# EAGLE board sd2snes17 (EAGLE 4.15), part 1 of 2
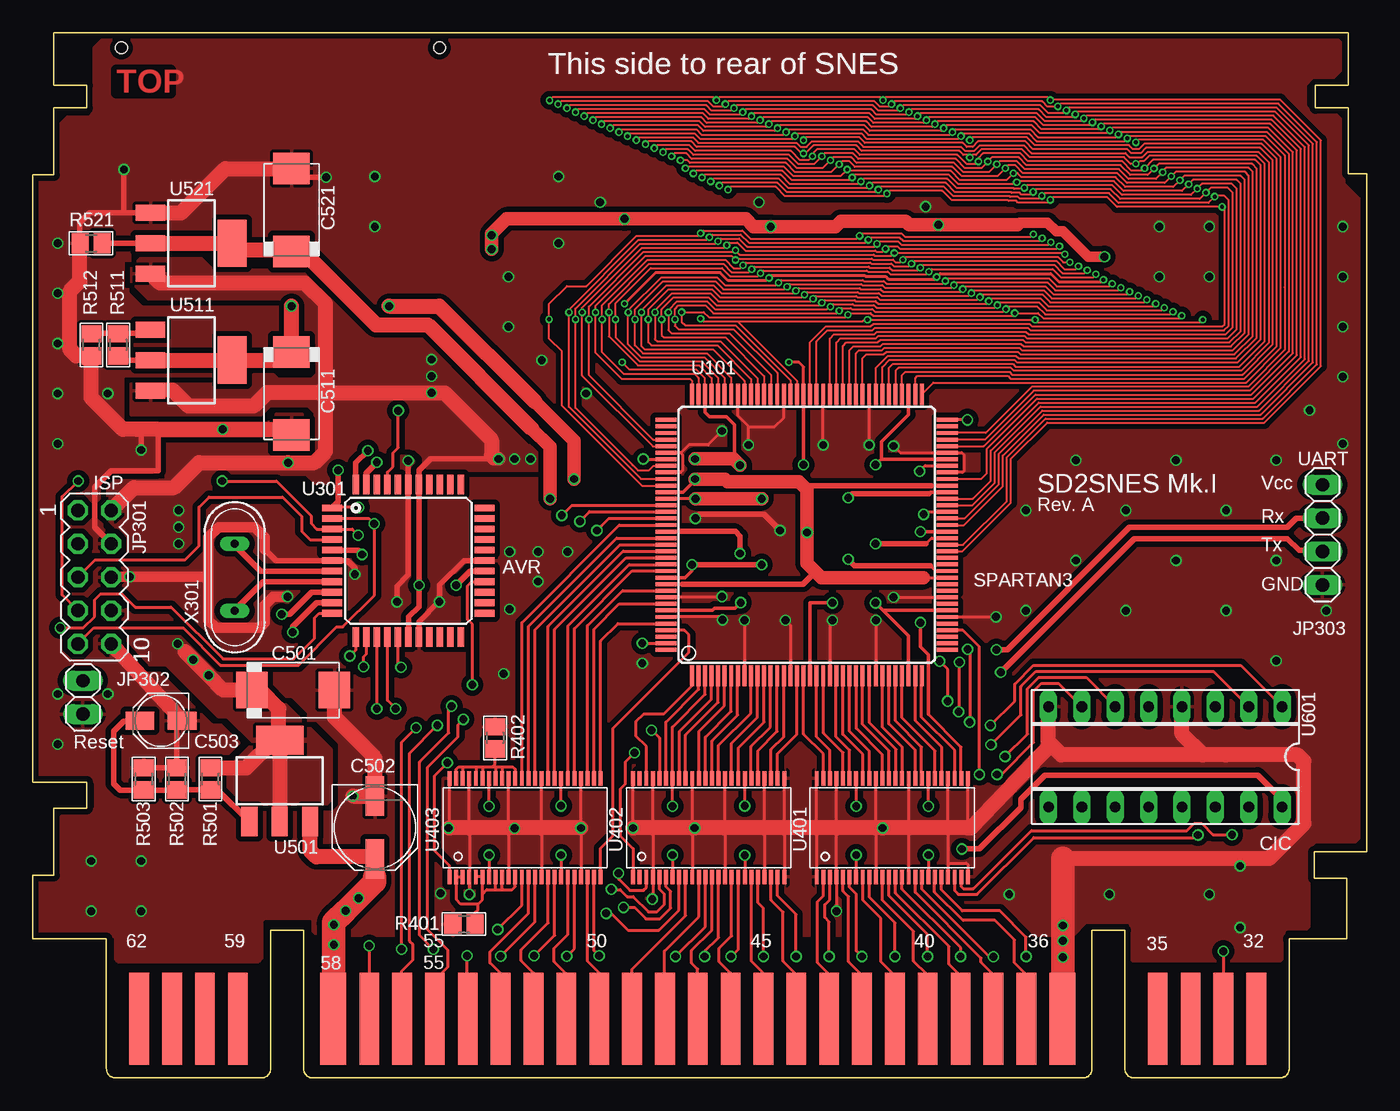
[diagram p4: board, top side]
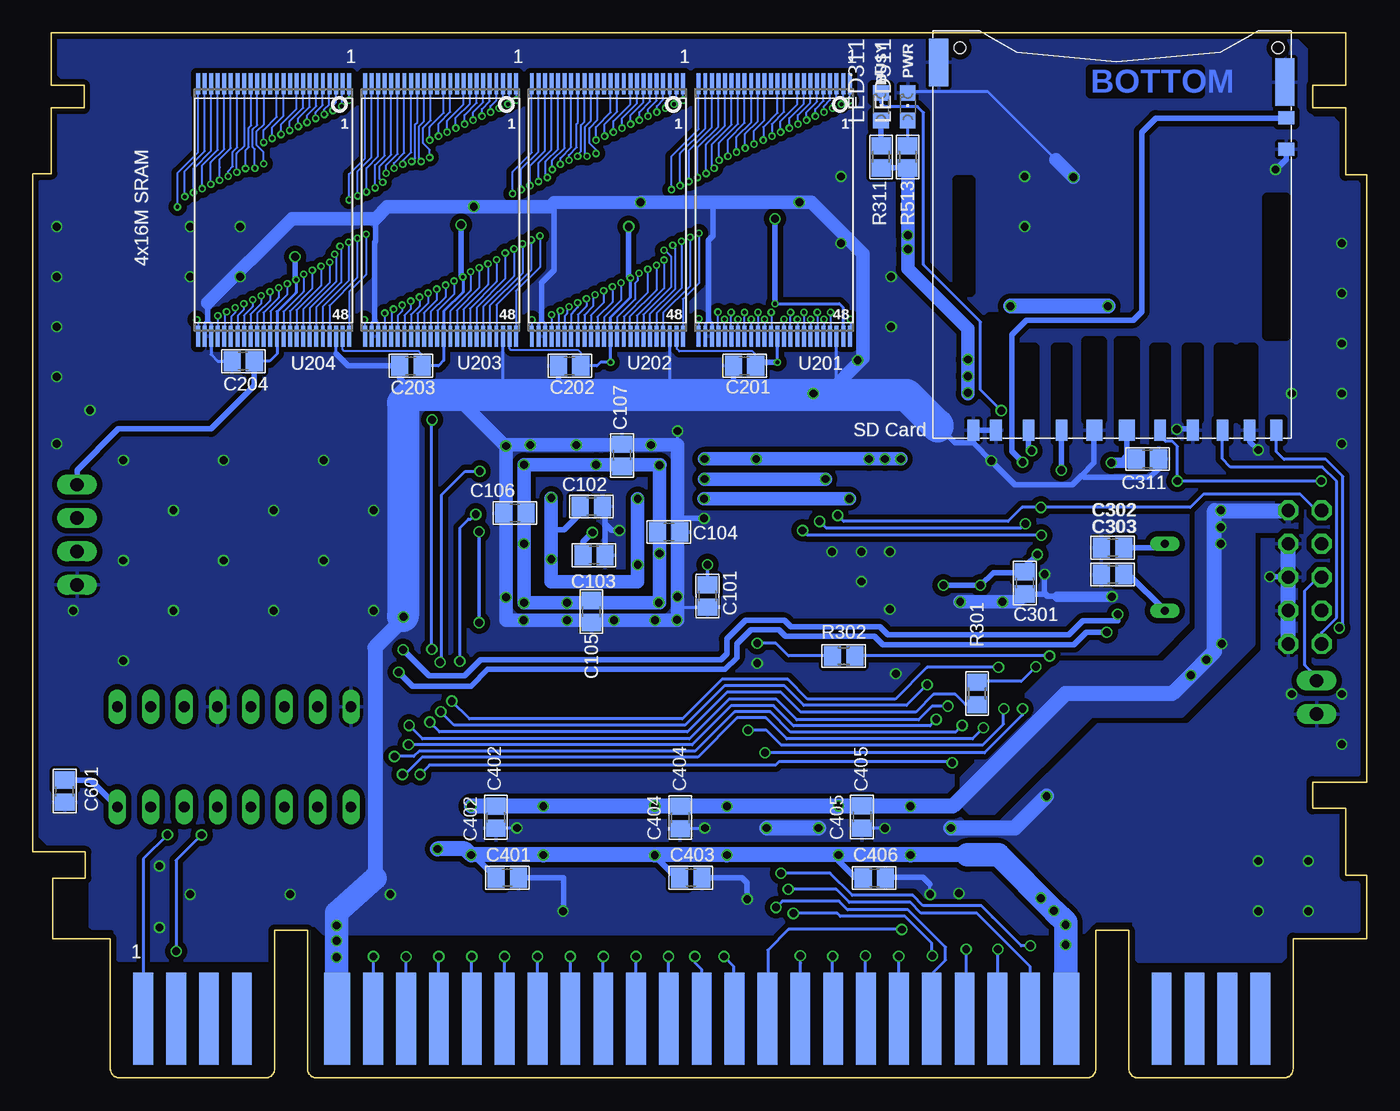
[diagram p5: board, bottom side, seen from below]

Size 101.5 x 79.5 mm. Coordinates in mm from the lower left corner, seen from the top.
Copper layers (1*16): Top 0.035mm / dielectric 1mm / Bottom 0.035mm
Design rules "myBilex DRU": minimum track width 0.15mm, minimum drill 0.3mm, track to track 0.15mm, track to pad 0.15mm, pad to pad 0.15mm, via to via 0.15mm, smd to smd 0.15mm, copper to edge 10mil, drill to drill 8mil, minimum pad ring 10mil, minimum via ring 5mil, stop-mask expansion 4mil, vias tented up to drill 0mil, thermal gap 10mil

## Footprints (pad centres in the part's own frame; a part is rotated, then mirrored left to right if it is on the bottom)
C0805 = smd 1.3 x 1.5: 1 -0.85,0; 2 0.85,0
SMC_D = smd 2.4 x 2.8: + -3.15,0; - 3.15,0
PANASONIC_D = smd 3 x 1.4: + 2.4,0; - -2.4,0
PANASONIC_B = smd 2.2 x 1.4: + 1.6,0; - -1.6,0
SNESCART = smd 1.5 x 7: 1 -42.5,-0.5; 2 -40,-0.5; 3 -37.5,-0.5; 4 -35,-0.5; 6 -25,-0.5; 7 -22.5,-0.5; 8 -20,-0.5; 9 -17.5,-0.5; 10 -15,-0.5; 11 -12.5,-0.5; 12 -10,-0.5; 13 -7.5,-0.5; 14 -5,-0.5; 15 -2.5,-0.5; 16 0,-0.5; 17 2.5,-0.5; 18 5,-0.5; 19 7.5,-0.5; 20 10,-0.5; 21 12.5,-0.5; 22 15,-0.5; 23 17.5,-0.5; 24 20,-0.5; 25 22.5,-0.5; 26 25,-0.5; 28 35,-0.5; 29 37.5,-0.5; 30 40,-0.5; 31 42.5,-0.5 | smd 2 x 7: 5 -27.75,-0.5; 27 27.75,-0.5 | smd 1.5 x 7 bottom: 32 -42.5,-0.5; 33 -40,-0.5; 34 -37.5,-0.5; 35 -35,-0.5; 37 -25,-0.5; 38 -22.5,-0.5; 39 -20,-0.5; 40 -17.5,-0.5; 41 -15,-0.5; 42 -12.5,-0.5; 43 -10,-0.5; 44 -7.5,-0.5; 45 -5,-0.5; 46 -2.5,-0.5; 47 0,-0.5; 48 2.5,-0.5; 49 5,-0.5; 50 7.5,-0.5; 51 10,-0.5; 52 12.5,-0.5; 53 15,-0.5; 54 17.5,-0.5; 55 20,-0.5; 56 22.5,-0.5; 57 25,-0.5; 59 35,-0.5; 60 37.5,-0.5; 61 40,-0.5; 62 42.5,-0.5 | smd 2 x 7 bottom: 36 -27.75,-0.5; 58 27.75,-0.5
JAE-SG5S009V1A = smd 0.9 x 1.6: 1 6.875,14.44; 2 4.375,14.44; 5 -3.125,14.44; 6 -5.625,14.44; 7 -7.875,14.44; 8 -9.925,14.44; 9 9.375,14.44; CARD_DET1 -11.975,14.44; CARD_DET2 11.075,14.44 | smd 1.2 x 1.6: 3 1.875,14.44; 4 -0.6,14.44 | smd 1.45 x 3.6: GND -12.625,-12.06; GND@1 13.725,-13.56 | smd 1.25 x 1: WP_1 -12.725,-9.36; WP_2 -12.725,-6.96 | hole 0.9: -12.1,-14.66; 12.1,-14.66
MA05-2 = drill 1.016 octagon: 1 -5.08,-1.27; 2 -5.08,1.27; 3 -2.54,-1.27; 4 -2.54,1.27; 5 0,-1.27; 6 0,1.27; 7 2.54,-1.27; 8 2.54,1.27; 9 5.08,-1.27; 10 5.08,1.27
1X02 = drill 1.016 long: 1 -1.27,0; 2 1.27,0
1X04 = drill 1.016 long: 1 -3.81,0; 2 -1.27,0; 3 1.27,0; 4 3.81,0
CHIPLED_0805 = smd 1.2 x 1.2: A 0,-1.05; C 0,1.05
R0805 = smd 1.3 x 1.5: 1 -0.85,0; 2 0.85,0
TQ144 = smd 1.6 x 0.3: P1 -10.7,8.75; P2 -10.7,8.25; P3 -10.7,7.75; P4 -10.7,7.25; P5 -10.7,6.75; P6 -10.7,6.25; P7 -10.7,5.75; P8 -10.7,5.25; P9 -10.7,4.75; P10 -10.7,4.25; P11 -10.7,3.75; P12 -10.7,3.25; P13 -10.7,2.75; P14 -10.7,2.25; P15 -10.7,1.75; P16 -10.7,1.25; P17 -10.7,0.75; P18 -10.7,0.25; P19 -10.7,-0.25; P20 -10.7,-0.75; P21 -10.7,-1.25; P22 -10.7,-1.75; P23 -10.7,-2.25; P24 -10.7,-2.75; P25 -10.7,-3.25; P26 -10.7,-3.75; P27 -10.7,-4.25; P28 -10.7,-4.75; P29 -10.7,-5.25; P30 -10.7,-5.75; P31 -10.7,-6.25; P32 -10.7,-6.75; P33 -10.7,-7.25; P34 -10.7,-7.75; P35 -10.7,-8.25; P36 -10.7,-8.75; P73 10.7,-8.75; P74 10.7,-8.25; P75 10.7,-7.75; P76 10.7,-7.25; P77 10.7,-6.75; P78 10.7,-6.25; P79 10.7,-5.75; P80 10.7,-5.25; P81 10.7,-4.75; P82 10.7,-4.25; P83 10.7,-3.75; P84 10.7,-3.25; P85 10.7,-2.75; P86 10.7,-2.25; P87 10.7,-1.75; P88 10.7,-1.25; P89 10.7,-0.75; P90 10.7,-0.25; P91 10.7,0.25; P92 10.7,0.75; P93 10.7,1.25; P94 10.7,1.75; P95 10.7,2.25; P96 10.7,2.75; P97 10.7,3.25; P98 10.7,3.75; P99 10.7,4.25; P100 10.7,4.75; P101 10.7,5.25; P102 10.7,5.75; P103 10.7,6.25; P104 10.7,6.75; P105 10.7,7.25; P106 10.7,7.75; P107 10.7,8.25; P108 10.7,8.75 | smd 0.3 x 1.6: P37 -8.75,-10.7; P38 -8.25,-10.7; P39 -7.75,-10.7; P40 -7.25,-10.7; P41 -6.75,-10.7; P42 -6.25,-10.7; P43 -5.75,-10.7; P44 -5.25,-10.7; P45 -4.75,-10.7; P46 -4.25,-10.7; P47 -3.75,-10.7; P48 -3.25,-10.7; P49 -2.75,-10.7; P50 -2.25,-10.7; P51 -1.75,-10.7; P52 -1.25,-10.7; P53 -0.75,-10.7; P54 -0.25,-10.7; P55 0.25,-10.7; P56 0.75,-10.7; P57 1.25,-10.7; P58 1.75,-10.7; P59 2.25,-10.7; P60 2.75,-10.7; P61 3.25,-10.7; P62 3.75,-10.7; P63 4.25,-10.7; P64 4.75,-10.7; P65 5.25,-10.7; P66 5.75,-10.7; P67 6.25,-10.7; P68 6.75,-10.7; P69 7.25,-10.7; P70 7.75,-10.7; P71 8.25,-10.7; P72 8.75,-10.7; P109 8.75,10.7; P110 8.25,10.7; P111 7.75,10.7; P112 7.25,10.7; P113 6.75,10.7; P114 6.25,10.7; P115 5.75,10.7; P116 5.25,10.7; P117 4.75,10.7; P118 4.25,10.7; P119 3.75,10.7; P120 3.25,10.7; P121 2.75,10.7; P122 2.25,10.7; P123 1.75,10.7; P124 1.25,10.7; P125 0.75,10.7; P126 0.25,10.7; P127 -0.25,10.7; P128 -0.75,10.7; P129 -1.25,10.7; P130 -1.75,10.7; P131 -2.25,10.7; P132 -2.75,10.7; P133 -3.25,10.7; P134 -3.75,10.7; P135 -4.25,10.7; P136 -4.75,10.7; P137 -5.25,10.7; P138 -5.75,10.7; P139 -6.25,10.7; P140 -6.75,10.7; P141 -7.25,10.7; P142 -7.75,10.7; P143 -8.25,10.7; P144 -8.75,10.7
TSOP48 = smd 0.3 x 1.6: 1 -5.75,-9.6; 2 -5.25,-9.6; 3 -4.75,-9.6; 4 -4.25,-9.6; 5 -3.75,-9.6; 6 -3.25,-9.6; 7 -2.75,-9.6; 8 -2.25,-9.6; 9 -1.75,-9.6; 10 -1.25,-9.6; 11 -0.75,-9.6; 12 -0.25,-9.6; 13 0.25,-9.6; 14 0.75,-9.6; 15 1.25,-9.6; 16 1.75,-9.6; 17 2.25,-9.6; 18 2.75,-9.6; 19 3.25,-9.6; 20 3.75,-9.6; 21 4.25,-9.6; 22 4.75,-9.6; 23 5.25,-9.6; 24 5.75,-9.6; 25 5.75,9.6; 26 5.25,9.6; 27 4.75,9.6; 28 4.25,9.6; 29 3.75,9.6; 30 3.25,9.6; 31 2.75,9.6; 32 2.25,9.6; 33 1.75,9.6; 34 1.25,9.6; 35 0.75,9.6; 36 0.25,9.6; 37 -0.25,9.6; 38 -0.75,9.6; 39 -1.25,9.6; 40 -1.75,9.6; 41 -2.25,9.6; 42 -2.75,9.6; 43 -3.25,9.6; 44 -3.75,9.6; 45 -4.25,9.6; 46 -4.75,9.6; 47 -5.25,9.6; 48 -5.75,9.6
TQFP44 = smd 1.5 x 0.5: 1 -5.8,4; 2 -5.8,3.2; 3 -5.8,2.4; 4 -5.8,1.6; 5 -5.8,0.8; 6 -5.8,0; 7 -5.8,-0.8; 8 -5.8,-1.6; 9 -5.8,-2.4; 10 -5.8,-3.2; 11 -5.8,-4; 23 5.8,-4; 24 5.8,-3.2; 25 5.8,-2.4; 26 5.8,-1.6; 27 5.8,-0.8; 28 5.8,0; 29 5.8,0.8; 30 5.8,1.6; 31 5.8,2.4; 32 5.8,3.2; 33 5.8,4 | smd 0.5 x 1.5: 12 -4,-5.8; 13 -3.2,-5.8; 14 -2.4,-5.8; 15 -1.6,-5.8; 16 -0.8,-5.8; 17 0,-5.8; 18 0.8,-5.8; 19 1.6,-5.8; 20 2.4,-5.8; 21 3.2,-5.8; 22 4,-5.8; 34 4,5.8; 35 3.2,5.8; 36 2.4,5.8; 37 1.6,5.8; 38 0.8,5.8; 39 0,5.8; 40 -0.8,5.8; 41 -1.6,5.8; 42 -2.4,5.8; 43 -3.2,5.8; 44 -4,5.8
TSSOP48 = smd 0.3 x 1.1: 1 -5.75,-3.75; 2 -5.25,-3.75; 3 -4.75,-3.75; 4 -4.25,-3.75; 5 -3.75,-3.75; 6 -3.25,-3.75; 7 -2.75,-3.75; 8 -2.25,-3.75; 9 -1.75,-3.75; 10 -1.25,-3.75; 11 -0.75,-3.75; 12 -0.25,-3.75; 13 0.25,-3.75; 14 0.75,-3.75; 15 1.25,-3.75; 16 1.75,-3.75; 17 2.25,-3.75; 18 2.75,-3.75; 19 3.25,-3.75; 20 3.75,-3.75; 21 4.25,-3.75; 22 4.75,-3.75; 23 5.25,-3.75; 24 5.75,-3.75; 25 5.75,3.75; 26 5.25,3.75; 27 4.75,3.75; 28 4.25,3.75; 29 3.75,3.75; 30 3.25,3.75; 31 2.75,3.75; 32 2.25,3.75; 33 1.75,3.75; 34 1.25,3.75; 35 0.75,3.75; 36 0.25,3.75; 37 -0.25,3.75; 38 -0.75,3.75; 39 -1.25,3.75; 40 -1.75,3.75; 41 -2.25,3.75; 42 -2.75,3.75; 43 -3.25,3.75; 44 -3.75,3.75; 45 -4.25,3.75; 46 -4.75,3.75; 47 -5.25,3.75; 48 -5.75,3.75
SOT223 = smd 1.219 x 2.235: 1 -2.311,-3.099; 2 0,-3.099; 3 2.311,-3.099 | smd 3.6 x 2.2: TAB 0,3.099
SOCKED-16 = drill 0.813 long: 1 -8.89,-3.81; 2 -6.35,-3.81; 3 -3.81,-3.81; 4 -1.27,-3.81; 5 1.27,-3.81; 6 3.81,-3.81; 7 6.35,-3.81; 8 8.89,-3.81; 9 8.89,3.81; 10 6.35,3.81; 11 3.81,3.81; 12 1.27,3.81; 13 -1.27,3.81; 14 -3.81,3.81; 15 -6.35,3.81; 16 -8.89,3.81
QS = drill 0.61 long: 1 -2.54,0; 2 2.54,0

## Placement (x,y rotation side)
C101  100n  [C0805]  50.16,36.67 270 bottom
C102  100n  [C0805]  59,43.48 0 bottom
C103  100n  [C0805]  58.8,39.77 0 bottom
C104  100n  [C0805]  53.11,41.52 0 bottom
C105  100n  [C0805]  59,35.48 270 bottom
C106  100n  [C0805]  64.82,42.97 180 bottom
C107  100n  [C0805]  56.66,47.36 90 bottom
C201  100n  [C0805]  47.34,54.17 180 bottom
C202  100n  [C0805]  60.65,54.17 180 bottom
C203  100n  [C0805]  72.74,54.17 180 bottom
C204  100n  [C0805]  85.49,54.53 180 bottom
C301  100n  [C0805]  26,37.66 270 bottom
C302  22p  [C0805]  19.32,40.33 0 bottom
C303  22p  [C0805]  19.32,38.3 0 bottom
C311  100n  [C0805]  16.68,47.08 0 bottom
C401  100n  [C0805]  65.4,15.23 0 bottom
C402  100n  [C0805]  66.26,19.83 270 bottom
C403  100n  [C0805]  51.43,15.23 0 bottom
C404  100n  [C0805]  52.24,19.8 270 bottom
C405  100n  [C0805]  38.4,19.86 90 bottom
C406  100n  [C0805]  37.46,15.21 0 bottom
C501  T_100u  [SMC_D]  19.81,29.51 0 top
C502  100u/16V  [PANASONIC_D]  26.03,19.04 270 top
C503  22u/16V  [PANASONIC_B]  9.75,27.17 180 top
C511  T_100u  [SMC_D]  19.68,52.06 270 top
C521  T_100u  [SMC_D]  19.68,66.03 90 top
C601  100n  [C0805]  99.08,21.81 270 bottom
J1  CARTSLOT  [SNESCART]  50.6,5 0 bottom
J301  JAE-SG5S009V1A  [JAE-SG5S009V1A]  18.84,63.7 180 bottom
JP301  [MA05-2]  4.69,38.09 270 top
JP302  [1X02]  3.81,28.95 270 top
JP303  [1X04]  98.14,41.32 270 top
LED311  RED  [CHIPLED_0805]  36.95,73.88 0 bottom
LED511  GREEN  [CHIPLED_0805]  34.92,73.88 0 bottom
R301  270  [R0805]  29.64,29.25 90 bottom
R302  270  [R0805]  39.8,32.1 0 bottom
R311  82  [R0805]  36.95,70.07 90 bottom
R401  10k  [R0805]  32.81,11.7 0 top
R402  10k  [R0805]  35.17,25.87 270 top
R501  100  [R0805]  13.51,22.75 90 top
R502  180  [R0805]  10.97,22.75 270 top
R503  2k2  [R0805]  8.43,22.75 270 top
R511  100  [R0805]  6.5,55.77 270 top
R512  100  [R0805]  4.47,55.77 90 top
R513  82  [R0805]  34.92,70.07 270 bottom
R521  100  [R0805]  4.44,63.49 0 top
U101  XC3S200TQ144TQ144  [TQ144]  58.9,41.31 90 top
U201  CY62167DV30ZXI  [TSOP48]  45.08,66.03 180 bottom
U202  CY62167DV30ZXI  [TSOP48]  57.78,66.03 180 bottom
U203  CY62167DV30ZXI  [TSOP48]  70.48,66.03 180 bottom
U204  CY62167DV30ZXI  [TSOP48]  83.18,66.03 180 bottom
U301  ATMEGA644-20AU  [TQFP44]  28.58,39.35 0 top
U401  74ALVC164245DGG  [TSSOP48]  65.4,19.04 0 top
U402  74ALVC164245DGG  [TSSOP48]  51.43,19.04 0 top
U403  74ALVC164245DGG  [TSSOP48]  37.46,19.04 0 top
U501  LM1117MPX-ADJ  [SOT223]  18.79,22.6 0 top
U511  LM1117MPX-ADJ  [SOT223]  12.06,54.6 270 top
U521  LM1117MPX-ADJ  [SOT223]  12.06,63.49 270 top
U601  CIC  [SOCKED-16]  86.18,24.43 180 top
X301  13.5MHz  [QS]  15.36,38.09 90 top

## Tracks (layer width: path | path; a pad name or v marks a point on that pad's centre or on a via)
+1.25V  (via drill 0.6)
  Top 0.229: U101.P121 v50.41,44.06 | v50.16,39.03 50.16,38.6 | U101.P49 68.74,38.56 68.32,38.98
  Top 0.254: U101.P133 49.62,38.06 50.16,38.6 | U101.P61 68.32,44.57 68.19,44.44
  Top 0.406: R521.2 U521.2 | v55.47,39.03 v50.16,39.03 | 68.19,44.44 62.35,44.44 v62.05,44.14 | 68.32,38.98 62.53,38.98 v62.05,39.46
  Top 1.016: v50.41,44.06 v55.47,44.06 | v39.37,44.06 39.37,48 37.97,49.4
  Top 1.143: U521.2 9.09,63.49 9.11,63.47 9.14,63.49 U521.TAB 15.67,62.98 19.66,62.98 19.66,62.91 C521.+ 19.63,62.93 19.63,62.96 20.44,62.96 26.11,57.29 30.07,57.29 37.97,49.4
  Bottom 0.229: C101.1 50.16,37.66 | 62.05,44.11 v62.05,44.14 | 62.05,41.7 62.07,41.7
  Bottom 0.254: v50.16,39.03 C101.1
  Bottom 0.406: C102.1 59.85,42.93 61.08,41.7 62.05,41.7
  Bottom 1.016: v39.37,44.06 v50.41,44.06 | v55.47,44.06 v55.47,39.03 55.47,37.74 62.05,37.74 v62.05,39.46 62.05,41.7 62.05,44.11
+2.5V  (via drill 0.6)
  Top 0.229: v50.39,45.56 50.39,45.48 | U101.P48 67.74,38.06 67.74,38.07 | 58.8,44.87 58.98,45.06
  Top 0.254: U101.P120 49.47,44.56 50.39,45.48 | U101.P134 48.61,37.56 49.43,37.56 | U101.P62 69.62,45.05 | U101.P62 | 68.37,45.05 U101.P62
  Top 0.406: 59.57,38.51 58.62,37.56 49.43,37.56 | 58.92,41.52 58.95,41.52 v58.92,41.5 | R511.2 6.82,54.6 9.34,54.6 | 58.98,45.06 59,45.05 68.37,45.05
  Top 1.016: 38.22,51.43 41.19,48.46 v41.19,45.56 | v50.39,45.56 52.68,45.56 52.88,45.36 58.31,45.36 58.8,44.87 58.92,44.75 58.92,41.52 58.92,39.16 59.57,38.51 60.02,38.07 67.74,38.07 67.76,38.07
  Top 1.143: U511.2 9.34,54.6 U511.TAB 19.68,54.6 | 19.68,54.6 v19.68,58.72 | 19.68,54.6 C511.+ | 38.22,51.43 30.93,58.72 v27.1,58.72
  Bottom 0.406: C103.1 59.65,40.77 v58.92,41.5
  Bottom 1.016: v41.19,45.56 v50.39,45.56
  Bottom 1.143: v19.68,58.72 v27.1,58.72
+3V3  (via drill 0.3, 0.6)
  Top 0.152: v44.85,54.45 45.41,53.89 50.49,53.89 51.15,53.24 U101.P106
  Top 0.229: U101.P3 51.15,30.62 | U101.P3 | U101.P3 51.15,29.18 48.66,26.69 48.66,22.81 U402.42 48.68,20.75 v48.69,20.67 | U403.42 34.71,20.75 v34.72,20.67 | U403.31 v40.21,20.7 v40.2,20.69 | U402.31 v54.18,20.7 v54.17,20.69 | U401.31 v68.14,20.67 | U401.42 v62.66,20.67 | 59.15,36.14 59.15,36.13 | v64.13,36.14 64.7,35.56 | U101.P54 68.4,41.06 67.97,40.63 | v64.13,46.65 64.54,47.06 64.59,47.06 | v58.64,46.65 58.65,46.63 | 53.36,47.06 53.39,47.08 | U101.P115 46.45,47.06 v46.45,47.08 | U101.P91 58.65,52.14 58.64,52.14 58.64,54.09 58.29,54.45 v57.53,54.45 | 56,60.83 55.82,60.65 52.9,60.65 52.29,61.26 47.39,61.26 v45.03,58.9 | v56.03,60.85 56,60.83 | 56,60.83 56.23,61.05 63.32,61.05 63.39,60.98 64.92,60.98 65.12,60.77 68.63,60.77 v68.78,60.93 69.03,61.18 77.47,61.18 78.08,60.57 81.33,60.57 v81.48,60.72
  Top 0.254: U101.P138 51.72,35.56 51.89,35.73 53.44,35.73 v53.87,36.16 | 59.15,36.13 U101.P19 | v60.85,36.14 59.15,36.14 | U101.P34 66.65,33.62 v64.13,36.14 | 64.7,35.56 U101.P43 | U101.P66 64.59,47.06 64.59,48.4 66.65,50.46 U101.P75 | 58.65,46.63 U101.P91 | U101.P106 51.15,50.64 51.48,50.31 52.78,50.31 53.39,49.7 53.39,47.08 | U101.P126 49.32,41.57
  Top 0.406: v64.13,40.63 67.97,40.63 | v35.45,47.08 35.45,47.11 30.27,47.11 29.38,46.22 U301.38 v29.38,37.49 v29.38,37.48 29.38,35.86 28.6,35.07 28.6,33.53 | 28.6,33.53 28.6,33.24 | 28.6,33.53 U301.17 | U301.5 24.74,40.15 v25.07,39.82 | U301.27 33.27,38.55 v32.2,37.48 | 49.32,41.57 53.46,41.57 53.82,41.22 v53.82,39.9
  Top 0.813: 74.93,64.89 75.1,65.07 77.21,65.07 77.87,64.41 78.38,64.41 80.31,62.48 v81.55,62.48
  Top 1.016: 34.9,47.44 34.93,47.35 35.05,47.08 v35.45,47.08 | v50.39,47.08 53.34,47.08 53.36,47.06 | 53.36,47.06 53.69,46.73 | 53.36,47.06 v53.82,46.6 | v34.92,63.04 v34.92,64.1 34.92,64.2 36.06,65.35 v45.03,65.35 54.25,65.35 54.83,64.76 v56.15,64.76 61.08,64.76 61.49,65.17 66.39,65.17 66.7,64.89 v68.91,64.89 74.93,64.89
  Top 1.143: U501.TAB U501.2 | 13.5,23.59 13.41,23.59 | R501.2 13.5,23.59 | 13.5,23.59 16.25,23.59 18.36,25.7 U501.TAB | JP301.2 7.69,44.9 10.74,44.9 12.64,46.8 v19.43,46.8 21.43,46.8 22.27,47.64 22.27,52.11 | 22.27,52.11 22.27,51.96 22.09,52.14 17.83,52.14 16.78,51.1 11.86,51.1 10.64,52.32 8.99,52.32 U511.3 | U521.3 9.67,60.47 20.7,60.47 22.27,58.9 22.27,52.11 | 22.27,52.11 v30.35,52.11 31.34,52.11 34.9,48.56 34.9,47.34 34.91,47.35 34.93,47.35 | U501.TAB 18.72,25.7 18.72,28.1 17.33,29.48 16.68,29.48 C501.+ 14.49,29.51 v13.38,30.62 v12.19,31.82 11.58,32.43 | U501.TAB
  Bottom 0.152: 44.85,56.48 44.83,56.46 U201.37 | U202.47 52.5,56.4 52.5,55.47 52.29,55.26 46.73,55.26 46.5,55.03 46.5,54.42 46.49,54.44 C201.1 | U203.47 65.23,55.5 65.1,55.36 59.99,55.36 59.79,55.16 59.79,54.17 | U204.47 77.93,55.42 77.8,55.29 72.13,55.29 71.9,55.06 71.9,54.2 71.89,54.18 C203.1
  Bottom 0.229: 40.2,20.67 v40.2,20.69 | 36.67,20.67 36.67,20.72 36.69,20.71 C405.2 | 54.17,20.67 v54.17,20.69 54.2,20.69 54.16,20.65 C404.1 | C402.1 66.28,20.67 v68.14,20.67 | 53.82,36.19 53.87,36.19 v53.87,36.16 | 64.13,36.24 64.08,36.24 v64.13,36.14 | v64.13,40.63 64.11,40.63 63.97,40.77 C106.1 | v64.13,46.65 64.03,46.63 | 58.62,46.65 58.62,46.63 v58.64,46.65 | 46.4,47.08 46.4,47.06 v46.45,47.08 | 53.82,43.1 53.84,43.1 53.84,42.87 | C104.1 53.84,41.63 53.84,42.87 | 53.82,42.87 53.84,42.87 | 44.85,56.48 v44.85,54.45 44.83,54.42 | v56.03,60.85 56.03,59.38 57.53,57.88 U202.37 v57.53,54.45 | v45.03,58.9 40.13,58.9 39.85,58.62 39.85,56.43 U201.47 | v68.78,60.93 68.78,59.78 70.23,58.33 U203.37 70.23,54.58 70.63,54.17 C203.1 | U204.37 82.93,58.29 81.48,59.73 v81.48,60.72 | 46.52,54.42 46.55,54.42 | 46.52,54.42 C201.1 | 46.5,54.42 46.52,54.42 | U204.37 82.95,56.41 82.93,56.38 | C204.1 83.49,54.53 82.93,55.09 82.93,56.33 82.95,56.36 82.93,56.38 U204.37 | 59.79,54.17 58.57,54.17 58.29,54.45 v57.53,54.45 | v57.53,54.45 57.48,54.45
  Bottom 0.406: v25.07,39.82 25.07,39.85 26.03,38.88 26.03,38.49 | 26.03,38.45 26.03,38.4 | 26.03,38.45 26.03,38.49 | 26.03,38.49 C301.1 | 26.03,38.45 28.42,38.45 v29.38,37.48 v32.2,37.48 | 44.83,54.42 46.5,54.42 | 59.79,54.17 C202.1 | 81.55,62.45 81.55,60.72 v81.48,60.72 | v68.91,64.89 68.91,61.05 v68.78,60.93 | v56.15,64.76 56.15,60.98 v56.03,60.85 | v45.03,65.35 v45.03,58.9 | C204.1 84.65,54.51 84.65,52.65 87.93,49.37 94.99,49.37 98.12,46.25 98.12,45.15 JP303.1 | 18.23,47.08 18.26,47.08 | 18.23,47.08 C311.1 | 18.23,47.08 18.23,49.22 | R513.2 34.91,69.22 | 34.91,69.22 R311.1 | 34.91,69.22 34.9,69.21
  Bottom 0.813: v19.43,46.8 18.23,46.8 18.23,47.08 | 18.23,49.22 J301.4
  Bottom 1.016: v35.45,47.08 v36.65,47.08 v37.87,47.08 46.4,47.08 v50.39,47.08 | v53.82,46.6 53.82,43.1 53.82,42.87 v53.82,39.9 53.82,36.19 53.82,36.14 57.63,36.14 | 57.63,36.14 v60.85,36.14 v64.13,36.14 64.13,36.24 v64.13,40.63 v64.13,46.65 58.62,46.65 57.88,46.65 | 57.88,46.65 53.79,46.65 | C107.1 56.66,46.65 57.88,46.65 | C105.1 59,36.14 57.63,36.14 | R513.2 v34.92,64.1 v34.92,63.04 34.92,61.56 30.35,56.99 v30.35,54.65 v30.35,53.38 30.35,52.06
  Bottom 1.143: v68.14,20.67 v62.66,20.67 54.17,20.67 v48.69,20.67 40.2,20.67 36.67,20.67 v34.72,20.67 31.49,20.67 22.93,29.23 14.8,29.23 v13.38,30.62 v12.19,31.82 11.58,32.43 11.58,43.15 5.94,43.15 | 5.94,43.15 5.86,43.15 | 5.94,43.15 JP301.2
  other vias: 11.02,33.04 11.09,40.63 11.09,41.9 11.09,43.17
  pour Top (isolate 0.406): 27.73,46.19 27.73,47.57 28.04,47.87 29.05,47.87 29.69,47.24 29.69,46.73 30.17,46.25 38.91,46.25 39.06,46.4 39.06,47.57 38.53,48.1 37.71,48.1 32.33,53.48 29.15,56.76 25.42,56.76 20.75,61.43 13.76,61.43 12.9,62.3 8.12,62.3 7.49,61.66 7.49,60.52 8.73,59.28 19.93,59.28 20.62,58.59 20.62,56.84 21.59,55.87 21.59,53.56 21.18,53.15 18.69,53.15 17.95,53.89 17.14,53.89 16.02,52.77 7.44,52.77 7.44,50.46 7.72,50.18 17.14,50.18 18.11,51.15 20.9,51.15 21.46,50.59 21.46,45.89 22.09,45.26 26.79,45.26
  pour Bottom (isolate 0.406): 29.66,25.29 23.39,31.56 15.41,31.56 12.87,34.1 12.87,43.15 12.09,43.93 5.38,43.93 5.35,42.99 5.38,42.18 5.38,41.67 8.68,41.67 8.68,33.01 14.09,27.6 21,27.6 28.67,19.93 29.84,19.93 30.78,20.87 30.78,22.75 29.66,23.87
  pour Top (isolate 0.406): 10.21,31.51 14.17,27.55 14.88,27.55 16.94,25.49 14.93,23.49 14.93,21.96 16,20.9 22.27,20.9 22.63,21.23 22.63,24.91 19.2,28.31 17.45,28.31 16.73,29.02 16.73,31.01 16.35,31.39 14.17,31.39 12.06,33.49 7.46,33.49 7.11,33.14 7.11,31.51
  pour Top (isolate 0.406): 5.76,42.59 6.37,41.95 6.62,41.95 7.23,41.34 7.23,40.07 7.36,39.95 11.48,39.95 12.29,40.76 12.29,43.4 14.42,45.53 14.65,45.53 15.13,46.02 20.85,46.02 21.51,45.36 22.19,45.36 22.42,45.59 22.42,47.95 22.17,48.2 10.21,48.2 10.21,45.38 6.04,45.38 5.76,45.1
+5V  (via drill 0.6)
  Top 0.229: U403.18 40.21,16.93 v40.2,16.96 | U403.7 34.71,16.9 v34.72,16.96 | U402.18 v54.18,16.93 v54.17,16.93 | U402.7 48.68,16.9 v48.69,16.96 | U401.7 62.65,16.9 v62.66,16.96 | U401.18 68.15,16.9 v68.14,16.96
  Top 0.406: U601.16 95.07,21.18 93.21,23.03 77.01,23.03 75.18,21.2 75.18,20.57 72.03,17.42 v70.71,17.42
  Top 1.143: J1.27 23.06,4.54 | 26.01,16.67 26.01,16.81 21.56,16.81 21.1,17.26 U501.3 | 26.01,16.67 C502.+ | 26.01,15.26 26.01,15.97 | 26.01,15.97 26.01,16.67 | 26.01,15.97 26.03,15.97 26,15.94 | U501.3
  Top 1.2: J1.27 23.11,4.5
  Top 1.778: 26.01,15.26 26.01,14.93 v23.8,12.72 22.91,11.83 v22.91,11.65 22.91,10.1 | J1.27 22.87,4.5 22.91,4.46 22.91,10.1 | v22.91,10.13 22.91,10.1
  Bottom 0.229: 54.17,16.99 54.17,16.96 v54.17,16.93 | v68.14,16.96 68.14,16.99 | 40.23,16.96 40.2,16.93
  Bottom 0.406: 40.2,16.93 40.2,16.53 38.91,15.23 38.3,15.23 38.31,15.22 C406.1 | v68.14,16.96 68.14,16.83 67.85,16.83 C401.1 | v54.17,16.93 54.17,16.88 52.52,15.23 C403.1 | J1.27 23.06,4.54 | 23.74,12.72 23.72,12.69 | v23.8,12.72 23.74,12.72 | v24.79,13.68 24.71,13.68 23.74,12.72 | C601.1 97.11,22.66 U601.16
  Bottom 1.143: 30.37,16.96 v34.72,16.96 v40.2,16.96 40.23,16.96 v48.69,16.96 54.17,16.96 v62.66,16.96 v68.14,16.96 68.6,17.42 v70.71,17.42
  Bottom 1.778: 30.37,16.96 28.04,16.96 v23.8,12.72 22.91,11.83 v22.91,11.65 v22.91,10.13 22.91,4.23 22.85,4.29 J1.27
BANK0_CE  (via drill 0.3)
  Top 0.152: v45.92,71.34 46.12,71.54 50.24,71.54 50.64,71.14 58.11,71.14 58.42,70.83 58.87,70.83 59.28,71.24 62.78,71.24 63.19,70.83 70.63,70.83 70.94,70.53 71.65,70.53 72.06,70.93 75.41,70.93 75.99,70.35 83.16,70.35 83.46,70.05 84.43,70.05 84.83,70.45 93.26,70.45 94.05,69.66 94.05,55.92 91.94,53.82 74.65,53.82 74.44,54.02 65.88,54.02 65.65,53.78 U101.P77
  Bottom 0.152: U201.12 44.83,73.42 45.92,72.33 v45.92,71.34
BANK1_CE  (via drill 0.3)
  Top 0.152: v58.64,71.34 58.85,71.54 62.91,71.54 63.32,71.14 70.76,71.14 71.06,70.83 71.52,70.83 71.93,71.24 75.54,71.24 76.12,70.66 83.28,70.66 83.59,70.35 84.3,70.35 84.7,70.76 93.39,70.76 94.36,69.79 94.36,55.8 92.07,53.51 74.52,53.51 74.32,53.71 66.39,53.71 66.15,53.47 U101.P76
  Bottom 0.152: U202.12 57.53,73.45 58.64,72.33 v58.64,71.34
BANK2_CE  (via drill 0.3)
  Top 0.152: v71.29,71.34 71.5,71.54 75.66,71.54 76.25,70.96 83.41,70.96 83.71,70.66 84.17,70.66 84.58,71.06 93.52,71.06 94.66,69.92 94.66,55.67 92.2,53.21 74.39,53.21 74.19,53.41 67.33,53.41 67.15,53.22 U101.P74
  Bottom 0.152: U203.12 70.23,73.42 71.29,72.36 v71.29,71.34
BANK3_CE  (via drill 0.3)
  Top 0.152: v83.94,71.16 84.15,71.37 93.65,71.37 94.97,70.05 94.97,55.54 92.32,52.9 68.52,52.9 U101.P73
  Bottom 0.152: U204.12 82.93,73.12 83.94,72.1 v83.94,71.16
CCLK  (via drill 0.6)
  Top 0.229: U101.P72 | 69.64,50.06 U101.P72 | v71.29,27.07 71.34,27.12 71.34,32.4 v71.14,32.61 | U101.P72 v71.12,50.06
  Bottom 0.229: 29.63,28.42 29.59,28.42 | R301.1 29.63,28.42 | 29.63,28.42 30.55,28.42 31.31,29.18 32.96,29.18 34.31,27.83 43.05,27.83 44.57,29.35 48.66,29.35 51.68,26.33 70.56,26.33 v71.29,27.07 | v71.12,50.06 71.14,50.06 v71.14,32.61
CCLK_AVR  (via drill 0.6)
  Top 0.229: U301.13 25.4,33.53 25.4,32.25 25.17,32.02 v25.17,31.29
  Bottom 0.229: 29.7,30.17 29.76,30.17 | 29.7,30.17 R301.2 | v25.17,31.29 26.28,30.17 29.7,30.17
DIN/FPGA_SS  (via drill 0.6)
  Top 0.229: U301.26 34.37,37.74 33.37,37.74 33.07,37.43 33.07,34.89 33.45,34.51 v33.45,29.91 | U101.P65 69.59,46.58 67.89,46.58 67.46,46.14 v67.48,46.14 | v70.46,27.86 70.51,27.91 v70.51,31.62
  Bottom 0.229: v33.45,29.91 35.02,28.34 42.82,28.34 44.32,29.84 48.87,29.84 51.86,26.84 69.44,26.84 v70.46,27.86 | 67.46,46.14 v67.48,46.14 68.6,46.14 70.38,44.37 70.38,31.74 v70.51,31.62
GND  (via drill 0.6)
  Top 0.229: 38.71,19.02 38.71,18.99 | U403.34 38.71,19 38.71,18.99 | 36.22,19.04 36.22,19.02 36.22,18.99 36.6,18.99 | 36.22,19.04 36.22,19.07 36.21,19.07 U403.39 | 33.21,19.07 33.21,19.03 33.22,19.02 | 33.21,19.07 U403.45 | U403.48 31.71,19.03 31.69,19.02 | U403.4 | 36.22,19.04 36.27,18.99 36.6,18.99 | U403.10 36.21,19.04 36.22,19.04 | U403.15 38.71,18.99 | 38.71,18.99 38.43,18.99 38.35,19.07 36.67,19.07 36.6,18.99 | 36.6,18.99 v36.65,18.99 | v41.7,19.02 41.7,19.09 | U403.21 41.71,19.09 41.7,19.09 | U403.28 41.71,19.1 41.7,19.09 | 33.21,19.07 33.22,19.07 | 50.34,19.02 50.34,19.04 v50.36,19.02 | U402.39 50.18,19.02 50.19,19.02 | U402.48 45.68,19.03 45.69,19.02 | U402.45 47.18,19 47.19,18.99 47.19,19.02 47.18,19.01 U402.4 | U402.34 52.68,19.1 52.6,19.02 52.32,19.02 52.24,18.94 50.41,18.94 50.36,18.99 | U402.28 55.68,19.03 55.67,19.02 55.67,18.99 55.68,18.98 U402.21 | U402.25 57.18,19.03 57.17,19.02 57.18,19.01 U402.24 | U401.48 59.65,19.03 59.66,19.02 | 61.16,19.02 61.16,19.07 61.15,19.08 U401.45 | U401.39 64.15,19.1 64.16,19.09 64.16,19.02 U401.10 | 66.65,19.07 66.65,19.04 66.67,19.02 | 66.65,19.07 U401.34 | U401.28 69.65,19.03 69.64,19.02 69.64,16.35 | U401.25 71.15,19.03 71.14,19.02 | v50.36,19.02 50.36,18.99 | U402.10 50.18,18.81 50.36,18.99 | U402.15 52.68,18.66 52.24,19.09 50.39,19.09 50.31,19.02 v50.36,19.02 | 47.19,15.46 47.18,15.45 U402.4 | U401.1 59.63,15.31 59.63,19.02 | U401.4 61.13,15.31 61.13,19.02 | 66.65,19.07 U401.15 | U401.21 69.64,16.35 | U401.24 71.14,16.22 71.01,16.35 69.64,16.35 | 64.64,19.02 64.64,19.04 v64.66,19.02 | 61.16,15.31 U401.4 | 61.16,15.31 61.15,15.31 U401.4 | 61.16,15.31 v61.16,12.69
  Top 0.229: U403.4 | 33.24,19.02 33.24,18.99 33.22,18.97 | U403.4 | v47.14,13.61 47.11,13.61 47.19,13.68 47.19,13.66 v47.14,13.61 | U101.P114 48.22,47.54 49.3,47.54 | 49.3,47.54 49.32,47.54 49.93,48.15 51.38,48.15 v52.45,49.22 | U101.P117 49.29,46.06 49.45,46.22 49.45,47.39 49.3,47.54 | U101.P139 48.19,35.06 48.18,35.07 52.24,35.07 v52.47,34.84 | U101.P136 52.44,36.56 v52.45,36.62 | U101.P16 57.65,34.44 v57.27,34.82 | U101.P22 60.65,34.56 v60.85,34.82 | U101.P29 64.15,34.81 v64.16,34.82 | U101.P9 v54.15,34.81 v54.15,34.82 | U101.P42 v73.29,35.06 v73.3,35.07 | U101.P45 v65.51,36.56 v65.5,36.57 | U101.P101 53.65,50.38 54.45,49.57 54.45,49.52 | v54.45,48.15 54.45,49.52 | U101.P94 57.15,50.23 56.43,49.52 54.45,49.52 | U101.P88 v60.14,48.15 | U101.P81 v63.65,48.15 | 69.57,47.56 66.01,47.56 66.01,47.57 | 69.57,47.56 U101.P67 70.68,47.57 70.84,47.41 70.84,46.17 70.73,46.06 U101.P64 | 69.57,47.56 69.57,47.57 66.01,47.57 | v65.5,48.07 66.01,47.57 | 33.22,19.02 33.22,19.04 | 33.22,19.02 v33.22,13.96 33.22,15.28 U403.4 | U402.4 47.18,13.65 v47.14,13.61
  Top 0.406: 10.94,23.58 10.94,23.54 | 10.94,23.58 R502.1 10.95,23.61 8.41,23.61 | C503.- 10.94,26.76 10.94,23.58 | 8.41,23.61 8.4,23.61 | R503.1 8.41,23.61 | 3.53,63.54 3.58,63.49 R521.1 3.55,63.49 3.53,63.52 3.58,63.57 3.58,65.07 4.31,65.8 6.93,65.8 | 6.93,65.8 U521.1 | 28.57,45.13 28.58,45.14 U301.39 | 28.57,45.13 v28.57,46.96 | v56.87,41.65 55.65,42.87 50.72,42.87 v50.41,42.56 | JP301.4 4.69,41.9 4.69,44.93 5.96,46.2 9.52,46.2 9.52,49.34 | 6.93,65.8 v6.93,69.11 | U301.6 22.77,39.34 22.35,39.34 | 22.35,39.34 18.51,39.34 17.62,40.23 | 28.57,45.13 28.57,38.27 27.71,37.41 v27.71,36.21 | U301.28 32.8,39.35 30.96,37.51 30.96,36.19 v30.93,36.21 | U301.18 29.38,34.71 30.88,36.21 v30.93,36.21 | v27.71,36.21 27.71,36.19 | v30.93,36.21 30.96,36.21 | 7.92,49.34 7.92,49.32 8.25,48.99 v8.25,47.77 | 22.35,39.34 23.95,39.34 24.51,38.78 v24.51,38.32 | v27.71,36.21 27.73,36.24 | 22.35,68.52 v22.32,68.52 20.34,68.52 C521.-
  Top 0.813: 17.62,40.23 17.62,41.14 16.86,41.9 14.14,41.9 13.36,41.12 13.36,38.12 | 13.36,38.12 13.36,34.82 13.94,34.23 17.24,34.23 17.62,34.61 17.62,35.96 18.28,36.62 v19.38,36.62 | 5.94,38.12 v7.36,38.12 13.36,38.12
  Top 1.143: 31.72,19.02 33.22,19.02 33.24,19.02 36.22,19.02 38.71,19.02 v41.7,19.02 | 45.72,19.02 47.19,19.02 50.19,19.02 50.31,19.02 50.34,19.02 v50.36,19.02 52.6,19.02 55.67,19.02 57.17,19.02 59.63,19.02 59.66,19.02 61.13,19.02 61.16,19.02 64.16,19.02 64.64,19.02 v64.66,19.02 66.67,19.02 69.64,19.02 71.14,19.02 71.37,19.02 77.47,25.37 | 78.38,4.16 78.38,4.4 J1.36 | 90.78,24.58 96.24,24.58 96.72,24.1 96.72,19.35 94.08,16.71 78.38,16.71 78.35,16.71 | 90.78,24.58 89.02,24.58 87.45,26.15 U601.4 | U601.8 77.29,25.54 77.47,25.37 | 77.47,25.37 78.25,24.58 90.78,24.58 | 77.47,25.37 77.49,25.39 | JP301.10 5.96,32.99 6.52,32.43 C503.- | v24.35,21.43 26.02,21.43 C502.- 26.03,24.35 22.96,27.42 C501.- | 31.72,19.02 31.69,19.02 | 31.72,19.02 v31.64,19.02 | 45.72,19.02 45.69,19.02 | 45.72,19.02 v45.66,19.02 | 19.71,49.34 19.68,49.37 C511.- | 19.71,49.34 v14.45,49.34 9.52,49.34 7.92,49.34 6.85,49.34 4.44,51.76 4.44,54.9 R512.1 4.45,54.93 3.3,54.93 2.81,55.42 2.81,59.83 3.58,60.6 3.58,63.49 | 19.71,49.34 19.73,49.32 | U521.1 11.27,65.8 14.65,69.18 C521.- | C521.-
  Top 1.778: 78.38,4.4 v78.38,9.19 v78.38,10.43 v78.38,11.6 78.38,16.71
  Bottom 0.152: 54.33,51.94 54.3,51.96
  Bottom 0.229: C405.1 36.66,19.01 v36.65,18.99 | C404.2 50.43,18.95 v50.36,19.02 | C402.2 64.7,18.98 v64.66,19.02 | 33.7,15.21 C406.2 | v33.22,13.96 33.22,14.72 | 52.42,48.15 52.45,48.15 v52.45,49.22 | 55.62,48.15 55.62,48.13 55.65,48.1 56.66,48.1 | 52.45,35.96 52.47,35.96 | 52.47,35.96 52.46,35.97 | 52.48,35.97 52.45,35.93 52.47,35.93 52.47,35.96 | 52.45,34.87 52.47,34.87 v52.47,34.84 | v60.85,34.82 60.85,34.79 60.88,34.82 | 73.33,35.15 73.3,35.15 v73.3,35.07 | 52.45,40.48 52.37,40.48 52.37,41.41 C104.2 | 60.17,48.15 v60.14,48.15 | v65.5,48.07 65.48,48.07 | 65.63,42.97 C106.2 65.67,46.06 65.63,46.09 65.63,46.07 65.5,46.07 65.38,46.07 | 52.45,35.83 52.47,35.83 52.46,35.82 C101.2 | C102.2 58.11,43.48 58.09,43.5 57.95,43.36 | JP301.10 JP301.8 | JP301.4 5.94,40.63 | JP301.6 5.94,38.12 5.94,37.99 | 51.13,51.94 51.13,51.86 51.1,51.88 | 51.66,51.94 51.66,52.19 51.6,52.25 | 13.24,49.28 13.2,49.37 13.25,49.37 | 23.64,69.84 28.82,75.02 34.79,75.02 34.9,74.92 34.9,74.93 LED511.C | LED511.C 34.92,75 | LED511.C 34.92,74.87 | 40.33,56.51 U201.46 40.33,51.94 | C201.2 48.2,54.44 | 54.3,51.96 53.03,53.08 U202.46 | U202.46 | 88.18,57.7 88.18,57.68 | U204.27 87.93,57.42 88.18,57.68 | U204.26 88.43,57.43 88.18,57.68 | U203.26 75.73,57.43 75.48,57.68 75.23,57.42 U203.27 | 67,51.94 67,52.09 | U202.26 63.03,57.35 62.78,57.6 | U202.27 62.53,57.37 62.78,57.63 | U201.26 50.33,57.38 50.08,57.63 | U201.27 49.83,57.4 50.08,57.65 | 78.43,55.08 U204.46 | C203.2 73.5,54.17 | 87.93,56.36 | U204.27 87.93,56.36 | 41.6,51.94 41.6,51.83 | C204.2 87.42,54.53 87.93,55.03 87.93,56.36 | U204.27 87.93,56.41 87.96,56.38 87.93,56.36 | 65.73,51.94 65.73,52.14 | 65.73,52.14 U203.46
  Bottom 0.229: 65.73,52.14 | 34.94,74.93 34.95,74.92 | LED511.C 34.94,74.93 | 34.94,74.93 34.92,74.95
  Bottom 0.406: 33.22,14.72 33.7,15.21 33.78,15.28 36.65,15.28 36.7,15.23 36.67,15.21 C406.2 | C401.2 61.13,15.23 61.13,12.67 v61.16,12.69 | C403.2 47.52,15.23 47.14,14.85 v47.14,13.61 | 32.63,49.67 32.66,49.67 | J1.36 78.1,4.49 78.13,4.46 | C102.2 57.96,43.48 57.96,42.16 | C103.2 57.96,42.16 | 58.09,43.5 57.96,43.38 57.96,42.16 | 57.96,42.16 57.45,41.65 v56.87,41.65 | 52.45,42.56 v50.41,42.56 | J301.WP_2 6.12,69.89 v6.93,69.11 | 28.52,46.88 28.6,46.96 v28.57,46.96 28.57,46.93 28.52,46.88 | 28.52,46.88 26.77,45.13 22.4,45.13 21.66,45.86 | J1.36 78.1,4.5 78.1,4.67 | 78.38,9.14 v78.38,9.19 | J1.36 | 28.52,46.88 29.94,48.3 | 21.66,45.86 20.75,46.78 20.75,49.27 J301.3 | J301.8 8.89,49.25 8.89,48.4 v8.25,47.77 | v14.45,49.34 14.42,49.37 13.25,49.37 | v24.51,38.32 24.51,36.9 24.25,36.64 | 24.25,36.64 21.81,36.64 | 24.25,36.64 24.28,36.64 24.44,36.81 C301.2 | 29.94,48.3 29.94,49.24 J301.CARD_DET2 29.9,49.27 28.23,49.27 J301.9 | 32.63,49.57 32.61,49.57 31.34,48.3 29.94,48.3 | 5.94,38.12 v7.36,38.12 | 88.18,58.97 88.18,57.7 | 75.48,57.68 75.48,63.57 75.41,63.64 75.41,65.35 75.43,65.37 | 61.5,52.33 C202.2 | 62.78,57.6 62.78,57.63 62.78,60.5 61.84,61.44 61.84,66.59 | 50.08,57.63 50.08,57.65 50.08,63.72 49.73,64.08 49.73,66.62 | 72.94,51.73 72.8,52.86 73.21,52.86 73.58,53.23 73.58,54.12 73.55,54.15 73.58,54.17 C203.2 77.52,54.17 78.43,55.08 | 48.2,51.94 48.2,51.99 48.19,52 C201.2 | C311.2 15.83,46.36 16.51,45.69 21.48,45.69 21.66,45.86
  Bottom 0.813: v19.38,36.62 23.54,36.62
  Bottom 1.016: 73.33,51.35 68.83,52.62 | 57.37,34.82 v57.27,34.82 v54.15,34.82 52.45,34.82 52.45,34.87 52.45,35.83 52.45,35.93 52.45,35.96 v52.45,36.62 52.45,40.48 52.45,42.56 52.45,48.15 v54.45,48.15 55.62,48.15 60.17,48.15 v63.65,48.15 65.63,48.15 69.52,52.04 69.52,51.94 | 57.37,34.82 60.88,34.82 v64.16,34.82 65.5,34.82 v65.5,36.57 65.5,46.07 v65.5,48.07 | 56.66,48.1 C107.2 | C105.2 59,34.82 57.37,34.82 | 30.96,36.21 v30.93,36.21 27.96,36.21 | v22.32,68.52 23.64,69.84 | 27.96,36.21 v27.71,36.21 | C301.2 26.6,36.21 27.96,36.21 | 42.92,51.94 42.92,52.06 42.91,52.07 | 42.2,51.95 41.1,51.95 38.32,54.73 38.32,62.68 42.24,66.62 v43.18,66.62 49.73,66.62 v55.27,66.62 61.84,66.59 62.15,66.29 v67.94,66.29 74.54,66.29 75.43,65.37 81.78,65.37 88.18,58.97 | 62.78,51.94 61.51,52.32 61.5,52.33
  Bottom 1.143: JP301.10 JP301.8 JP301.6 JP301.4 | v24.35,21.43 26.77,19.02 v31.64,19.02 | v45.66,19.02 v41.7,19.02 | 78.38,4.53 J1.36 | 75.46,15.18 75.46,32.76 73.33,34.89 73.33,35.1 v73.3,35.07 | 42.21,51.94 42.2,51.95
  Bottom 1.778: 78.38,9.14 78.38,12.57 75.46,15.18 | 78.38,9.14 78.38,4.53 | 78.38,9.14 J1.36
  Bottom 2.438: 73.33,35.15 73.33,51.35 72.94,51.73 72.74,51.94 69.52,51.94 67,51.94 65.73,51.94 62.78,51.94 54.33,51.94 51.66,51.94 51.13,51.94 48.2,51.94 42.92,51.94 42.21,51.94 41.6,51.94 40.33,51.94 35,51.94 32.63,49.57 32.63,49.67
  other vias: 4.44,16.5 8.25,16.5 8.25,12.69 4.44,12.69 85.72,64.76 89.53,64.76 89.53,60.95 40,63.49 40,68.57 74.29,13.96 81.91,13.96 89.53,13.96 36.19,60.95 36.19,57.14 38.73,54.6 42.11,52.06 79.37,46.98 86.99,46.98 94.61,46.98 75.56,43.17 83.18,43.17 90.8,43.17 94.61,39.36 86.99,39.36 79.37,39.36 75.56,35.55 83.18,35.55 90.8,35.55 98.42,35.55 94.61,31.74 1.9,63.49 1.9,59.68 1.9,55.87 1.9,52.06 5.71,52.06 1.9,48.25 1.9,29.2 5.71,29.2 1.9,25.39 26.03,68.57 26.03,64.76 46.38,31.54 85.72,60.95 91.87,11.45 91.87,16.12 97.15,50.79 99.69,48.25 99.69,53.33 99.69,57.14 99.69,60.95 99.69,64.76 36.29,35.65 35.83,30.75 36.29,40.02 38.45,40.02 40.69,40.02 38.45,37.76 31.03,14.04
  pour Top (isolate 0.406, rank 6): 0.33,11.09 0.63,10.79 6.09,10.79 6.27,10.61 6.27,9.06 6.47,8.86 17.17,8.86 17.45,9.14 17.45,11.93 17.67,12.16 21.13,12.16 21.31,11.98 21.31,11.14 21.59,10.86 79.22,10.86 80.18,11.83 83.41,11.83 83.54,11.7 83.54,9.06 83.69,8.91 94.97,8.91 95.25,9.19 95.25,11.14 95.45,11.35 96.97,11.35 97.12,11.5 97.12,17.44 97.63,17.95 100.66,17.95 100.99,18.28 100.99,66.85 99.79,68.04 99.79,72.69 99.11,73.37 97.43,73.37 96.87,73.93 96.87,75.53 97.46,76.12 99.03,76.12 99.54,76.62 99.54,78.78 99.26,79.06 5.33,79.06 4.64,78.38 4.64,73.5 4.24,73.09 2.59,73.09 2.08,72.59 2.08,68.65 1.7,68.27 0.55,68.27 0.27,67.99 0.27,23.13 0.5,22.9 4.29,22.9 4.74,22.45 4.74,20.54 4.36,20.16 2.41,20.16 2.08,19.83 2.08,15.28 1.75,14.95 0.5,14.95 0.33,14.78
  pour Bottom (isolate 0.406, rank 6): 4.59,78.28 4.59,73.6 4.03,73.04 2.54,73.04 2.05,72.56 2.05,68.5 1.75,68.19 0.71,68.19 0.4,67.89 0.4,23.26 0.63,23.03 4.19,23.03 4.59,22.62 4.59,20.49 4.11,20.01 2.15,20.01 1.82,19.68 1.82,15.49 1.34,15 0.81,15 0.48,14.67 0.48,11.32 0.86,10.94 5.61,10.94 6.01,10.53 6.01,9.31 6.5,8.83 17.37,8.83 17.7,9.16 17.7,11.9 20.62,11.9 21.59,10.94 79.37,10.94 80.01,11.57 83.31,11.57 83.48,11.4 83.48,9.09 83.66,8.91 94.97,8.91 95.25,9.19 95.25,11.17 95.42,11.35 96.97,11.35 97.15,11.5 97.15,17.06 97.79,17.7 100.33,17.7 101.11,18.48 101.11,68.04 100.55,68.6 100.15,68.6 99.84,68.9 99.84,73.35 99.51,73.68 97.3,73.68 97.07,73.91 97.07,75.46 97.61,75.99 99.23,75.99 99.69,76.45 99.69,78.99 99.44,79.24 5.56,79.24
INIT_B  (via drill 0.6)
  Top 0.229: 27.81,33.52 U301.16 27.78,31.46 v28.01,31.23 | U101.P58 67.99,43.07 v67.79,42.87 | v69.62,28.67 69.62,31.08 v69.01,31.69
  Bottom 0.229: v67.79,42.87 68.19,42.51 68.35,42.51 69.01,41.85 v69.01,31.69 | v28.01,31.23 33.45,31.23 35.86,28.82 42.54,28.82 44.04,30.32 49.07,30.32 52.07,27.32 68.27,27.32 v69.62,28.67
IRQ_DIR  (via drill 0.6)
  Top 0.229: U403.1 31.71,16.16 30.58,17.29 30.58,23 v31.54,23.97 | v72.03,23.08 72.03,32.81 70.79,34.05 69.57,34.05 69.56,34.06 | 69.56,34.06 69.54,34.08 | 69.56,34.06 U101.P40
  Bottom 0.229: v31.54,23.97 31.62,24.05 44.72,24.05 44.98,23.79 71.32,23.79 v72.03,23.08
MISO  (via drill 0.6)
  Top 0.229: U301.2 25.59,42.55 v25.98,42.16 26.01,42.13 26.01,36.72 23.59,34.31 23.11,34.31 20.21,31.41 14.27,31.41 11.45,34.23 4.64,34.23 JP301.9 | U101.P123 | U101.P123 | v41.63,42.33 42.36,43.07 U101.P123
  Bottom 0.229: v25.98,42.16 26.31,41.83 41.12,41.83 v41.63,42.33 | 3.48,32.99 3.45,32.99 JP301.9 3.42,33.88 2.28,35.02 2.28,45.38 3.37,46.47 10.36,46.47 10.97,47.08 J301.7 | 10.94,48.94 10.94,49.32 10.95,49.22 J301.7 | J301.7 10.97,49.29
MOSI  (via drill 0.6)
  Top 0.229: v24.79,43.4 23.19,43.4 | 23.19,43.4 22.8,43.4 | U101.P122 48.33,43.55 | U101.P122 | v40.25,42.79 41.02,43.55 U101.P122 | 22.81,43.38 22.86,43.38 | 22.81,43.38 U301.1 | 22.81,43.38 22.78,43.38 22.68,43.38 23.06,43.76 23.19,43.76 23.19,43.4
  Top 0.406: 23.24,45.99 v23.24,46.22 23.24,43.83 22.78,43.38
  Bottom 0.229: v40.25,42.79 39.8,42.33 27.3,42.33 26.23,43.4 v24.79,43.4 13.43,43.4 12.44,44.39 5.05,44.39 3.83,43.17 JP301.1
  Bottom 0.406: J301.2 23.24,49.22 v23.24,46.22
N$1  (via drill 0.6)
  Top 0.229: v72.87,26.81 74.72,28.67 74.72,29.96 76.14,31.39 91.92,31.39 U601.1 | v31.87,28.29 31.64,28.06 31.64,26.26 29.43,24.05 29.43,10.84 v30.48,9.8 30.48,9.77
  Bottom 0.229: v72.87,26.81 71.85,25.8 51.53,25.8 48.53,28.8 44.9,28.8 43.35,27.25 34.11,27.25 33.07,28.29 v31.87,28.29 31.85,28.29 | 30.63,4.23 30.63,4.47 J1.24 30.59,4.49 30.48,4.49 v30.48,9.8
N$2  (via drill 0.6)
  Top 0.229: v72.92,25.34 75.2,27.63 75.2,29.79 76.35,30.93 89.84,30.93 U601.2 | v32.76,27.27 32.36,26.87 32.36,25.95 30.04,23.64 30.04,11.27 31.59,9.72 31.59,8.45 30.6,7.46 J1.55 | J1.55 30.6,4.21 | J1.55
  Bottom 0.229: v32.76,27.27 32.74,27.27 33.22,26.79 43.61,26.79 45.13,28.31 48.36,28.31 51.33,25.34 v72.92,25.34
N$3  (via drill 0.6)
  Top 0.229: v73.99,24.45 75.69,26.15 75.69,29.61 76.55,30.47 80.16,30.47 82.39,28.24 U601.6 | v30.78,26.81 28.67,24.71 28.67,10.41 28.93,10.15 28.93,8.98 28.06,8.12 28.06,4.46 | 28.06,4.46 28.06,4.44 | J1.56 28.06,4.46
  Bottom 0.229: v30.78,26.81 31.29,26.31 43.84,26.31 45.39,27.86 48.1,27.86 51.1,24.86 72.11,24.86 72.51,24.45 v73.99,24.45
N$4  (via drill 0.6)
  Top 0.229: v73.38,23.08 73.71,23.08 76.14,25.52 76.14,29.41 76.75,30.02 78.05,30.02 U601.7 | v29.15,26.64 28.06,25.54 v28.06,9.8
  Bottom 0.229: v73.38,23.08 73.2,23.08 71.88,24.4 50.9,24.4 47.9,27.4 45.72,27.4 44.12,25.8 29.99,25.8 v29.15,26.64 | 28.06,4.46 28.06,4.18 | J1.25 28.06,4.46 | 28.06,4.46 v28.06,9.8
N$5
  Top 0.406: 15.26,40.63 15.24,40.66 | X301.2 15.26,40.63 | U301.7 17.35,38.55 15.26,40.63
  Bottom 0.406: 15.36,40.66 X301.2 15.34,40.63 | 15.34,40.63 15.31,40.66 | C302.2 15.64,40.33 15.34,40.63
N$6
  Top 0.406: X301.1 15.36,35.58 17.53,37.75 U301.8
  Bottom 0.406: X301.1 15.34,35.55 18.08,38.3 C303.2
N$7
  Bottom 0.406: 36.85,70.86 36.88,70.83 36.95,70.91 36.95,71.16 | 36.95,72.99 LED311.A 36.95,71.16 | R311.2 36.95,71.16
N$8
  Top 0.229: JP301.5 4.75,39.41 11.58,39.41 12.64,40.48 12.64,43.43 13.41,44.19 18.99,44.19 20.47,42.72 20.47,41.57 21.1,40.94 22.12,40.94 | 22.79,40.94 22.86,40.94 | 22.79,40.94 U301.4 | 22.12,40.94 22.07,40.94 | 22.12,40.94 22.79,40.94
  Bottom 0.229: JP301.5 3.68,38.09 4.69,37.08 4.69,31.41 3.81,30.52 JP302.1
N$9
  Bottom 0.229: 34.92,70.88 R513.1 LED511.A
N$10
  Top 0.229: U403.3 | U403.3 U403.2 32.23,15.31 | U403.3 32.74,15.31 | U403.5 U403.6 34.21,13.99 | 34.21,13.99 34.21,13.56 33.88,13.23 | 33.88,13.23 32.56,13.23 32.23,13.56 32.23,15.31 | 32.23,15.31 32.25,15.33 | U403.8 35.21,14.4 35.12,14.32 | 34.21,13.99 34.54,14.32 35.12,14.32 | U403.9 35.71,14.4 35.63,14.32 | U403.11 36.71,14.56 36.47,14.32 35.63,14.32 | 35.12,14.32 35.63,14.32 | 33.88,13.23 33.88,12.77 33.66,12.55 R401.2
N$11  (via drill 0.6)
  Top 0.229: v27.81,50.77 27.81,47.95 27.4,47.54 27.4,46.5 27,46.09 27,45.15 U301.41
  Bottom 0.229: v27.81,50.77 29.38,52.34 29.38,57.52 33.73,61.87 33.73,73.42 34.18,73.88 36.65,73.88 36.95,74.19 LED311.C
N$12
  Top 0.229: U403.47 32.21,23.47 32.41,23.67 32.71,23.67 | 32.71,23.67 33.7,23.67 | 33.7,23.67 34.23,23.67 | 34.23,23.67 35,23.67 | 35,23.67 35.2,23.67 | 35.2,23.67 35.71,23.67 | 35.71,23.67 36.52,23.67 36.7,23.49 36.7,22.83 36.72,22.8 U403.38 | U403.46 32.71,23.59 32.71,23.67 | U403.44 33.71,23.58 33.7,23.67 | U403.43 34.21,23.59 34.23,23.67 | U403.41 35.21,23.58 35.2,23.67 | U403.40 35.71,23.59 35.71,23.67 | R402.2 35.17,23.84 35,23.67
N$107
  Top 0.406: 6.51,56.63 6.68,56.63 | 6.51,56.63 R511.1 6.46,56.66 | R512.2 4.48,56.63 6.51,56.63 | 6.46,56.66 6.4,56.66 | U511.1 8.71,56.66 6.46,56.66
N$108
  Top 0.406: 10.98,21.89 10.99,21.89 | 10.98,21.89 R502.2 13.5,21.91 R501.1 13.48,21.93 13.48,21.94 14.04,21.94 U501.1 | 10.98,21.89 8.44,21.89 R503.2 8.41,21.89 6.65,21.89 6.14,22.4 6.14,26.36 6.93,27.15 8.12,27.15 C503.+
  Top 1.143: R501.1 13.53,21.88
PROG_B  (via drill 0.6)
  Top 0.229: U101.P143 v46.38,33.06
  Bottom 0.229: R302.1 43.99,32.1 44.95,33.06 v46.38,33.06
PROG_B_AVR  (via drill 0.6)
  Top 0.229: U301.12 24.58,32.56 v24.13,32.1
  Bottom 0.229: 39.06,32.1 R302.2 v24.13,32.1
RESET_DIR  (via drill 0.6)
  Top 0.229: U402.1 45.68,17.45 44.7,18.43 44.7,21.96 45.08,22.34 45.08,23.79 45.08,24.02 v45.79,24.73 | U301.14 26.21,33.52 26.18,33.5 v26.18,28.08
  Bottom 0.229: v45.79,24.73 29.08,24.73 26.18,27.63 v26.18,28.08
RXD  (via drill 0.6)
  Top 0.406: U301.9 21.2,36.95 19.53,35.27 v18.94,35.27 | v73.33,32.58 74.16,32.58 83.46,41.88 95.47,41.88 96.16,42.56 98.14,42.56 JP303.2
  Bottom 0.406: v18.94,35.27 18.94,34.77 21.61,34.77 22.68,33.7 36.44,33.7 37.05,34.31 43.81,34.31 44.32,34.82 47.26,34.82 48.69,33.39 48.69,32.25 49.12,31.82 67.43,31.82 68.65,30.6 71.34,30.6 v73.33,32.58
SCK  (via drill 0.6)
  Top 0.229: v24.76,41.29 24.31,41.75 U301.3 21.61,41.75 21.18,42.18 21.18,42.77 18.54,45.41 v14.4,45.41 | U101.P124 | v42.92,41.65 43.84,42.56 U101.P124 | JP301.7 2.23,36.75 2.23,44.21 v3.45,45.41
  Bottom 0.229: v24.76,41.29 42.57,41.29 v42.92,41.65 | J301.5 15.72,48.84 15.31,48.43 14.78,48.43 14.4,48.05 v14.4,45.41 v3.45,45.41
SD_DET  (via drill 0.6)
  Top 0.229: v2.08,34.23 3.83,34.23 4.69,35.1 4.69,36.37 5.15,36.82 6.78,36.82 7.79,35.81 10.51,35.81 14.47,31.87 19.86,31.87 21.43,33.44 21.43,34.99 21.79,35.35 U301.11 | U301.11 22.88,35.35 | U301.11
  Bottom 0.229: J301.CARD_DET1 6.87,47.63 6.29,47.06 3.09,47.06 1.8,45.76 1.8,34.51 v2.08,34.23
SD_SS  (via drill 0.6)
  Top 0.406: U301.44 24.58,46.8 v25.5,47.72
  Bottom 0.406: J301.1 25.72,49.23 25.73,49.22 25.73,47.95 v25.5,47.72
SD_WP  (via drill 0.6)
  Top 0.406: 25.37,45.14 25.37,45.1 | U301.43 25.37,45.14 | 25.37,45.14 25.37,46.02 v26.18,46.83
  Bottom 0.406: 6.08,73.02 6.07,73.02 | 6.08,73.02 J301.WP_1 | 6.08,73.02 16.05,73.02 17.12,71.95 17.12,58.29 17.75,57.65 25.88,57.65 27,56.53 27,47.67 26.16,46.83 v26.18,46.83
SNES_/IRQ
  Top 0.229: U403.37 37.21,34.64 44.62,42.05 U101.P125
SNES_/IRQ_EXT  (via drill 0.6)
  Top 0.229: v35.38,11.3 35.35,11.3 37.21,13.15 U403.12
  Bottom 0.229: J1.18 45.56,4.54 45.56,9.72 43.99,11.3 v35.38,11.3 35.35,11.3
SNES_/RD
  Top 0.229: U101.P2 50.67,30.59 50.67,29.56 48.18,27.07 U402.43 | U402.43 48.18,22.55 | U402.43
SNES_/RD_EXT  (via drill 0.6)
  Top 0.229: U402.6 48.18,14.55 48.53,14.19 48.53,12.92 47.72,12.11 46.66,12.11 45.79,12.97 v44.95,12.97
  Bottom 0.229: 33.04,4.49 33.09,4.49 J1.23 33.09,4.51 33.07,4.51 33.07,7.94 32.05,8.96 32.05,9.95 34.9,12.79 39.49,12.79 40.15,13.45 44.47,13.45 v44.95,12.97
SNES_/RESET  (via drill 0.6)
  Top 0.229: U402.44 47.68,25.87 v47.09,26.46 | 27,33.56 27,33.77 | 27,33.56 U301.15 | 27.63,28.08 27.66,28.06 | v27.61,28.08 27.63,28.08 | 27,33.56 27,28.72 27.63,28.08
  Bottom 0.229: v47.09,26.46 45.69,26.46 44.55,25.32 29.23,25.32 27.63,26.92 27.63,28.06 v27.61,28.08
SNES_/RESET_EXT  (via drill 0.6)
  Top 0.229: U402.5 47.67,14.37 48.05,13.99 48.05,13.2 47.49,12.64 46.83,12.64 45.69,13.78 45.23,13.78 44.7,14.32 43.99,14.32 | 43.99,14.32 43.96,14.32 | v44.01,14.34 43.99,14.32
  Bottom 0.229: J1.26 25.65,4.54 25.6,4.59 25.6,8.48 29.66,12.54 33.9,12.54 34.72,13.35 39.37,13.35 40.36,14.34 v44.01,14.34
SNES_/ROMSEL
  Top 0.229: U101.P5 52.14,28.57 49.68,26.1 U402.40 | U402.40 49.68,22.78 | U402.40
SNES_/ROMSEL_EXT
  Top 0.229: J1.49 45.6,4.55 45.59,4.56 45.61,4.59 45.61,8.27 49.68,12.34 U402.9
SNES_/WR
  Top 0.229: U402.41 49.2,22.81 49.2,26.36 51.63,28.8 51.63,30.6 U101.P4
SNES_/WR_EXT  (via drill 0.6)
  Top 0.229: J1.54 33.08,4.5 33.07,4.49 v33.04,9.29 | v43.63,12.51 44.01,12.51 45.28,11.24 47.65,11.24 49.17,12.77 49.17,15.28 U402.8
  Bottom 0.229: v43.63,12.51 40.28,12.51 40.05,12.29 35.12,12.29 33.09,10.25 33.09,9.24 v33.04,9.29
SNES_A0
  Top 0.229: U101.P7 53.13,30.6 53.13,27.88 51.18,25.93 U402.37 | U402.37 51.18,22.67 | U402.37
SNES_A0_EXT  (via drill 0.6)
  Top 0.229: U402.12 51.18,11.5 v48.92,9.24
  Bottom 0.229: J1.17 48.14,4.54 48.15,4.54 48.15,8.48 v48.92,9.24
SNES_A1
  Top 0.229: U402.35 52.17,22.81 52.17,25.29 54.63,27.75 54.63,30.63 | 54.63,30.63 54.63,30.75 | 54.63,30.63 U101.P10
SNES_A1_EXT  (via drill 0.6)
  Top 0.229: U402.14 52.18,10.67 51.13,9.62 v51.13,9.24
  Bottom 0.229: v51.13,9.24 51.13,8.78 50.59,8.25 50.59,4.64 50.62,4.62 50.6,4.6 J1.16
SNES_A2
  Top 0.229: U402.32 53.69,22.8 53.69,25.11 55.65,27.07 U101.P12 | U101.P12 55.65,30.78 | U101.P12
SNES_A2_EXT  (via drill 0.6)
  Top 0.229: U402.17 53.68,9.79 v53.13,9.24
  Bottom 0.229: J1.15 53.1,4.56 53.13,4.59 v53.13,9.24
SNES_A3
  Top 0.229: U402.29 55.16,22.81 55.16,24.88 56.64,26.36 56.64,30.6 U101.P14
SNES_A3_EXT  (via drill 0.6)
  Top 0.229: U402.20 55.18,13.34 55.6,12.92 v55.6,9.24
  Bottom 0.229: J1.14 55.57,4.54 55.6,4.56 v55.6,9.24
SNES_A4
  Top 0.229: U402.26 56.66,22.81 56.66,24.66 58.14,26.13 58.14,30.62 | 58.14,30.62 | 58.14,30.62 U101.P17
SNES_A4_EXT  (via drill 0.6)
  Top 0.229: v58.09,9.24 58.09,12.44 56.66,13.86 56.66,15.28 U402.23
  Bottom 0.229: J1.13 58.1,9.22 v58.09,9.24
SNES_A5
  Top 0.229: U401.46 60.65,24.94 59.63,25.95 59.63,30.52 59.65,30.54 U101.P20
SNES_A5_EXT  (via drill 0.6)
  Top 0.229: v60.6,9.24 60.6,11.88 60.27,12.21 60.27,13.18 60.65,13.56 U401.3 | U401.3 60.65,15.31 | U401.3
  Bottom 0.229: J1.12 v60.6,9.24
SNES_A6
  Top 0.229: 61.16,30.6 U101.P23 61.15,30.54 61.16,30.52 61.13,30.5 61.13,25.95 62.15,24.93 U401.43
SNES_A6_EXT  (via drill 0.6)
  Top 0.229: 62.15,15.23 U401.6 62.15,15.26 62.15,14.5 62.66,13.99 62.66,9.67 v63.09,9.24
  Bottom 0.229: J1.11 63.1,9.23 v63.09,9.24
SNES_A7
  Top 0.229: U401.40 63.65,24.86 62.15,26.36 62.15,30.5 U101.P25
SNES_A7_EXT  (via drill 0.6)
  Top 0.229: v65.6,9.24 65.6,11.8 63.65,13.76 63.65,15.26 U401.9
  Bottom 0.229: J1.10 v65.6,9.23 v65.6,9.24
SNES_A8
  Top 0.229: U401.37 65.15,24.88 63.14,26.89 63.14,30.55 63.15,30.56 U101.P27
SNES_A8_EXT  (via drill 0.6)
  Top 0.229: v68.09,9.24 68.09,10.91 65.15,13.86 65.15,15.21 U401.12
  Bottom 0.229: J1.9 68.1,9.23 v68.09,9.24
SNES_A9
  Top 0.229: U101.P30 64.65,26.68 66.16,25.16 66.16,22.88 66.19,22.85 66.15,22.82 U401.35
SNES_A9_EXT  (via drill 0.6)
  Top 0.229: U401.14 66.15,14.36 70.61,9.9 v70.61,9.24
  Bottom 0.229: J1.8 v70.61,9.24
SNES_A10
  Top 0.229: U101.P32 65.65,27.15 67.64,25.16 67.64,22.8 U401.32
SNES_A10_EXT  (via drill 0.6)
  Top 0.229: U401.17 67.65,14.35 72.79,9.21 v73.1,9.21
  Bottom 0.229: J1.7 73.1,4.61 73.1,4.62 v73.1,9.21
SNES_A11
  Top 0.229: U101.P35 67.15,27.18 69.16,25.16 69.16,22.85 69.15,22.84 U401.29
SNES_A11_EXT  (via drill 0.6)
  Top 0.229: U401.20 69.15,14.3 70.73,12.72 73.6,12.72 75.59,10.71 v75.59,9.24
  Bottom 0.229: J1.6 75.62,5.29 75.54,4.51 75.59,4.56 v75.59,9.24
SNES_A12
  Top 0.229: U101.P33 66.15,27.39 68.65,24.88 68.65,22.75 U401.30
SNES_A12_EXT
  Top 0.229: J1.37 75.6,7.85 74.7,8.76 74.7,10.51 73.22,11.98 70.79,11.98 68.63,14.14 68.63,15.28 68.64,15.29 U401.19
SNES_A13
  Top 0.229: U101.P31 65.15,26.94 67.15,24.94 67.15,22.83 67.15,22.82 U401.33
SNES_A13_EXT
  Top 0.229: J1.38 73.1,7.86 72.16,8.81 72.16,9.11 67.15,14.11 67.15,15.31 U401.16
SNES_A14
  Top 0.229: U101.P28 63.65,27.02 65.68,24.99 65.68,22.7 65.65,22.73 U401.36
SNES_A14_EXT
  Top 0.229: U401.13 65.65,14.07 69.72,10 69.72,8.65 70.58,7.79 70.58,4.62 70.61,4.59 70.6,4.58 J1.39
SNES_A15
  Top 0.229: U401.38 64.65,24.59 62.66,26.59 62.66,30.52 62.65,30.53 U101.P26
SNES_A15_EXT
  Top 0.229: U401.11 64.65,13.52 67.03,11.14 67.03,8.88 68.07,7.84 68.07,4.56 68.1,4.53 J1.40
SNES_A16
  Top 0.229: U401.41 63.15,24.62 61.64,26.13 61.64,30.6 U101.P24
SNES_A16_EXT
  Top 0.229: U401.8 63.15,13.52 64.54,12.13 64.54,8.86 65.6,7.79 65.6,4.49 65.6,4.48 | 65.6,4.48 65.58,4.46 | J1.41 65.6,4.48
SNES_A17
  Top 0.229: 61.62,22.62 61.65,22.66 U401.44 61.65,24.75 60.17,26.23 60.17,30.47 60.15,30.49 U101.P21
SNES_A17_EXT
  Top 0.229: U401.5 61.65,14.21 62.07,13.78 62.07,8.86 63.06,7.87 63.06,4.54 J1.42
SNES_A18
  Top 0.229: U401.47 60.15,24.65 58.64,26.15 U101.P18
SNES_A18_EXT
  Top 0.229: U401.2 60.15,13.84 59.71,13.4 59.71,8.78 60.6,7.89 60.6,4.56 J1.43
SNES_A19
  Top 0.229: U402.27 | U402.27 56.18,24.99 57.15,25.95 U101.P15 | U101.P15 57.15,30.78 | U101.P15
SNES_A19_EXT
  Top 0.229: U402.22 56.18,13.53 57.09,12.62 57.09,8.88 58.11,7.87 58.11,5.22 58.14,5.2 58.14,4.54 J1.44
SNES_A20
  Top 0.229: U402.30 54.66,22.82 54.66,25.21 56.13,26.69 56.13,30.63 | 56.13,30.63 56.13,30.83 | 56.13,30.63 U101.P13
SNES_A20_EXT
  Top 0.229: U402.19 54.68,8.88 55.6,7.97 55.6,4.46 | 55.6,4.46 55.62,4.44 | J1.45 55.6,4.46
SNES_A21
  Top 0.229: U402.33 53.18,25.47 55.14,27.42 55.14,30.62 | 55.14,30.62 55.14,30.83 | 55.14,30.62 U101.P11
SNES_A21_EXT
  Top 0.229: U402.16 53.18,10.81 52.22,9.85 52.22,8.86 53.11,7.97 53.11,4.59 53.16,4.54 53.12,4.5 J1.46
SNES_A22
  Top 0.229: U402.36 51.68,25.65 53.64,27.6 U101.P8 | U101.P8 53.64,30.7 | U101.P8
SNES_A22_EXT
  Top 0.229: U402.13 51.68,11.24 50.14,9.7 50.14,8.73 50.59,8.27 50.59,4.95 50.62,4.92 50.6,4.9 J1.47
SNES_A23
  Top 0.229: U101.P6 52.62,30.59 52.62,28.31 50.69,26.38 50.69,22.78 | 50.69,22.78 50.69,22.7 | U402.38 50.69,22.78
SNES_A23_EXT
  Top 0.229: U402.11 50.68,12.27 48.05,9.64 48.05,4.62 48.1,4.56 J1.48
SNES_CPU_CLK
  Top 0.229: U402.46 | 50.14,30.04 50.14,30.6 U101.P1 50.16,30.6 50.16,29.84 48.03,27.7 46.5,27.7 45.92,27.12 45.92,25.98 46.68,25.21 U402.46
SNES_CPU_CLK_EXT  (via drill 0.6)
  Top 0.229: U402.3 | J1.57 25.62,4.52 25.62,10.03 v25.6,10.05 | U402.3 46.68,14.47 46.48,14.27 45.44,14.27 44.6,15.11 v44.57,15.56
  Bottom 0.229: 28.44,12.21 26.28,10.05 v25.6,10.05 | 28.44,12.21 28.49,12.26 | 28.44,12.21 29.33,13.1 33.75,13.1 34.54,13.89 39.14,13.89 40.84,15.59 44.57,15.59 v44.57,15.56
SNES_D0
  Top 0.229: U403.26 42.71,34.15 44.62,36.06 48.15,36.06 48.16,36.06 U101.P137
SNES_D0_EXT  (via drill 0.6)
  Top 0.229: U403.23 42.71,9.68 v43.1,9.29
  Bottom 0.229: J1.19 43.09,4.51 43.07,4.51 43.07,8.73 v43.1,9.29
SNES_D1
  Top 0.229: U403.29 41.21,34.17 45.61,38.58 48.1,38.58 48.12,38.56 U101.P132
SNES_D1_EXT  (via drill 0.6)
  Top 0.229: U403.20 41.21,9.84 v40.64,9.26
  Bottom 0.229: J1.20 40.6,4.55 40.64,4.59 v40.64,9.26
SNES_D2
  Top 0.229: U403.32 39.71,34.12 45.16,39.57 U101.P130
SNES_D2_EXT  (via drill 0.6)
  Top 0.229: U403.17 39.71,10.85 v38.15,9.29
  Bottom 0.229: J1.21 38.1,4.54 38.15,4.59 v38.15,9.29
SNES_D3